# EAGLE design hw2 (EAGLE 7.5.0)
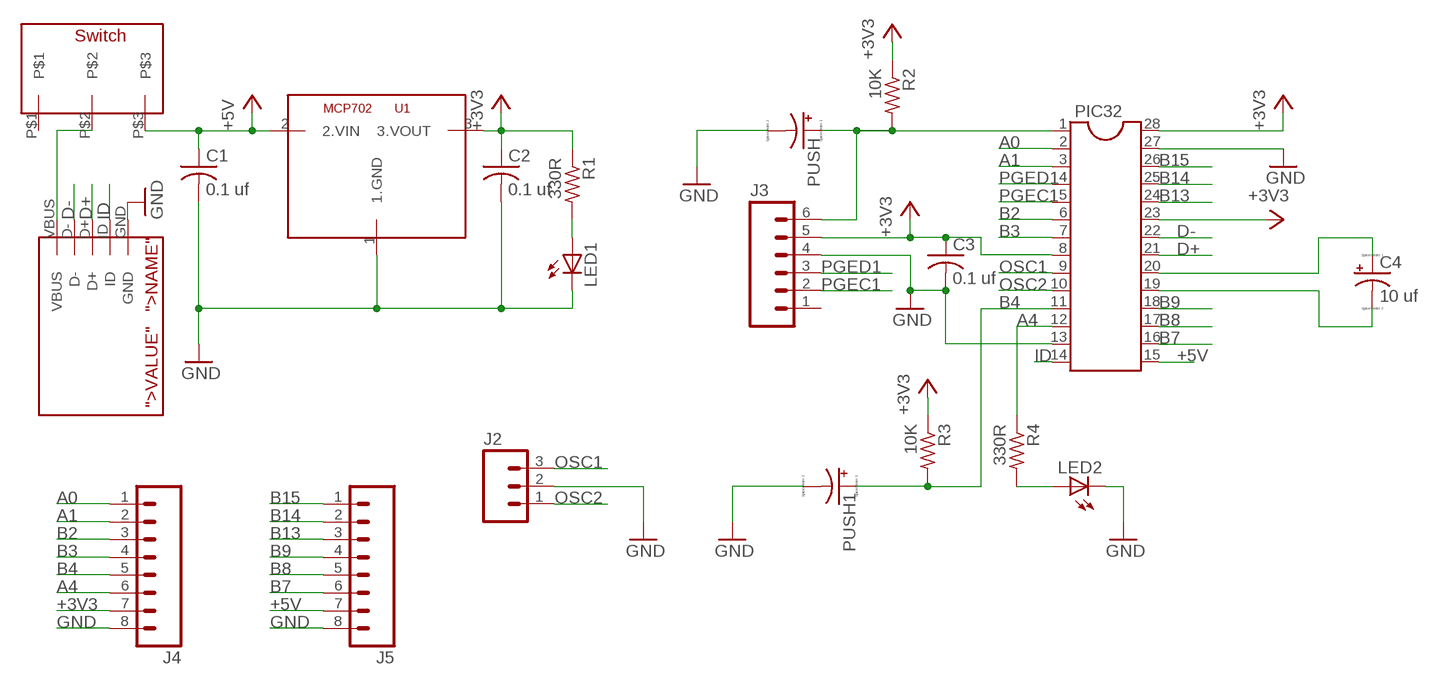
[diagram p0: schematic, sheet 1]

## Parts
C1  0.1 uf  C-US025-024X044  [C025-024X044]
C2  0.1 uf  C-US025-024X044  [C025-024X044]
C3  0.1 uf  C-US025-024X044  [C025-024X044]
C4  10 uf  CPOL-USTT2D4  [TT2D4]
J2  M03LOCK  [1X03_LOCK]
J3  M06NO_SILK_YES_STOP  [1X06_NO_SILK_YES_STOP]
J4  M08NO_SILK  [1X08_PIN1_NO_SILK]
J5  M08NO_SILK  [1X08_PIN1_NO_SILK]
LED1  LED3MM  [LED3MM]
LED2  LED3MM  [LED3MM]
PIC32  DIL28-3  [DIL28-3]
PUSH  CPOL-USTAP5-60  [TAP5-60]
PUSH1  CPOL-USTAP5-60  [TAP5-60]
R1  330R  R-US_0204/7  [0204/7]
R2  10K  R-US_0204/7  [0204/7]
R3  10K  R-US_0204/7  [0204/7]
R4  330R  R-US_0204/7  [0204/7]
U$1  SWITCH  [SWITCH]
U$2  MCP1702  [TO92]
U$3  USBNEW  [USB-MB-H]

## Nets
+3V3: C2.1 C3.1 J3.5(VDD) J4.7 PIC32.8 PIC32.23 PIC32.28 R1.1 R2.1 R3.1 U$2.3(3.VOUT)
+5V: C1.1 J5.7 PIC32.15 U$1.P$3 U$2.2(2.VIN)
A0: J4.1 PIC32.2
A1: J4.2 PIC32.3
A4: J4.6 PIC32.12 R4.1
B2: J4.3 PIC32.6
B3: J4.4 PIC32.7
B4: J4.5 PIC32.11 PUSH1.+ R3.2
B7: J5.6 PIC32.16
B8: J5.5 PIC32.17
B9: J5.4 PIC32.18
B13: J5.3 PIC32.24
B14: J5.2 PIC32.25
B15: J5.1 PIC32.26
D+: PIC32.21 U$3.D+
D-: PIC32.22 U$3.D-
GND: C1.2 C2.2 C3.2 J2.2 J3.4(VSS) J4.8 J5.8 LED1.K(C) LED2.K(C) PIC32.13 PIC32.27 PUSH1.- PUSH.- U$2.1(1.GND) U$3.GND
ID: PIC32.14 U$3.ID
N$1: U$1.P$2 U$3.VBUS
N$2: LED1.A R1.2
N$3: J3.6(MCLB) PIC32.1 PUSH.+ R2.2
N$6: LED2.A R4.2
N$7: C4.+ PIC32.20
N$8: C4.- PIC32.19
OSC1: J2.3 PIC32.9
OSC2: J2.1 PIC32.10
PGEC1: J3.2(PGC) PIC32.5
PGED1: J3.3(PGD) PIC32.4
Unconnected: J3.1(PGM) U$1.P$1

## Library data of the parts
C1-C3 = PIC32_Circuit:C-US: CAPACITOR, American symbol
C4 PUSH PUSH1 = PIC32_Circuit:CPOL-US: POLARIZED CAPACITOR, American symbol
J2 = PIC32_Circuit:M03: Header 3 Standard 3-pin 0.1" header. Use with straight break away headers (SKU : PRT-00116), right angle break away headers (PRT-00553), swiss pins (PRT-00743), machine pins (PRT-00117), and female headers (PRT-00115). Molex polarized connector foot print use with SKU : PRT-08232 with associated crimp pins and housings.
J3 = PIC32_Circuit:M06: Header 6 Standard 6-pin 0.1" header. Use with straight break away headers (SKU : PRT-00116), right angle break away headers (PRT-00553), swiss pins (PRT-00743), machine pins (PRT-00117), and female headers (PRT-00115). Molex polarized connector foot print use with SKU : PRT-08094 with associated crimp pins and housings. NOTES ON THE VARIANTS LOCK and LOCK_LONGPADS... This footprint was designed to help hold the alignment of a through-hole component (i.e. 6-pin header) while soldering it into place. You may notice that each hole has been shifted either up or down by 0.005 of an inch from it's more standard position (which is a perfectly straight line). This slight alteration caused the pins (the squares in the middle) to touch the edges of the holes. Because they are alternating, it causes a "brace" to hold the component in place. 0.005 has proven to be the perfect amount of "off-center" position when using our standard breakaway headers. Although looks a little odd when you look at the bare footprint, once you have a header in there, the alteration is very hard to notice. Also,if you push a header all the way into place, it is covered up entirely on the bottom side. This idea of altering the position of holes to aid alignment will be further integrated into the Sparkfun Library for other footprints. It can help hold any component with 3 or more connection pins.
J4 J5 = PIC32_Circuit:M08: Header 8 Standard 8-pin 0.1" header. Use with straight break away headers (SKU : PRT-00116), right angle break away headers (PRT-00553), swiss pins (PRT-00743), machine pins (PRT-00117), and female headers (PRT-00115).
LED1 LED2 = PIC32_Circuit:LED: LED OSRAM: - CHIPLED LG R971, LG N971, LY N971, LG Q971, LY Q971, LO R971, LY R971 LH N974, LH R974 LS Q976, LO Q976, LY Q976 LO Q996 - Hyper CHIPLED LW Q18S LB Q993, LB Q99A, LB R99A - SideLED LS A670, LO A670, LY A670, LG A670, LP A670 LB A673, LV A673, LT A673, LW A673 LH A674 LY A675 LS A676, LA A676, LO A676, LY A676, LW A676 LS A679, LY A679, LG A679 - Hyper Micro SIDELED® LS Y876, LA Y876, LO Y876, LY Y876 LT Y87S - SmartLED LW L88C, LW L88S LB L89C, LB L89S, LG L890 LS L89K, LO L89K, LY L89K LS L896, LA L896, LO L896, LY L896 - TOPLED LS T670, LO T670, LY T670, LG T670, LP T670 LSG T670, LSP T670, LSY T670, LOP T670, LYG T670 LG T671, LOG T671, LSG T671 LB T673, LV T673, LT T673, LW T673 LH T674 LS T676, LA T676, LO T676, LY T676, LB T676, LH T676, LSB T676, LW T676 LB T67C, LV T67C, LT T67C, LS T67K, LO T67K, LY T67K, LW E67C LS E67B, LA E67B, LO E67B, LY E67B, LB E67C, LV E67C, LT E67C LW T67C LS T679, LY T679, LG T679 LS T770, LO T770, LY T770, LG T770, LP T770 LB T773, LV T773, LT T773, LW T773 LH T774 LS E675, LA E675, LY E675, LS T675 LS T776, LA T776, LO T776, LY T776, LB T776 LHGB T686 LT T68C, LB T68C - Hyper Mini TOPLED® LB M676 - Mini TOPLED Santana® LG M470 LS M47K, LO M47K, LY M47K Source: http://www.osram.convergy.de LUXEON: - LUMILED® LXK2-PW12-R00, LXK2-PW12-S00, LXK2-PW14-U00, LXK2-PW14-V00 LXK2-PM12-R00, LXK2-PM12-S00, LXK2-PM14-U00 LXK2-PE12-Q00, LXK2-PE12-R00, LXK2-PE12-S00, LXK2-PE14-T00, LXK2-PE14-U00 LXK2-PB12-K00, LXK2-PB12-L00, LXK2-PB12-M00, LXK2-PB14-N00, LXK2-PB14-P00, LXK2-PB14-Q00 LXK2-PR12-L00, LXK2-PR12-M00, LXK2-PR14-Q00, LXK2-PR14-R00 LXK2-PD12-Q00, LXK2-PD12-R00, LXK2-PD12-S00 LXK2-PH12-R00, LXK2-PH12-S00 LXK2-PL12-P00, LXK2-PL12-Q00, LXK2-PL12-R00 Source: www.luxeon.com KINGBRIGHT: KA-3528ASYC Source: www.kingbright.com
PIC32 = PIC32_Circuit:DIL28: Dual In Line
R1-R4 = PIC32_Circuit:R-US_: RESISTOR, American symbol
U$1 = PIC32_Circuit:SWITCH
U$2 = PIC32_Circuit:MCP1702
U$3 = PIC32_Circuit:USBNEW

## Board
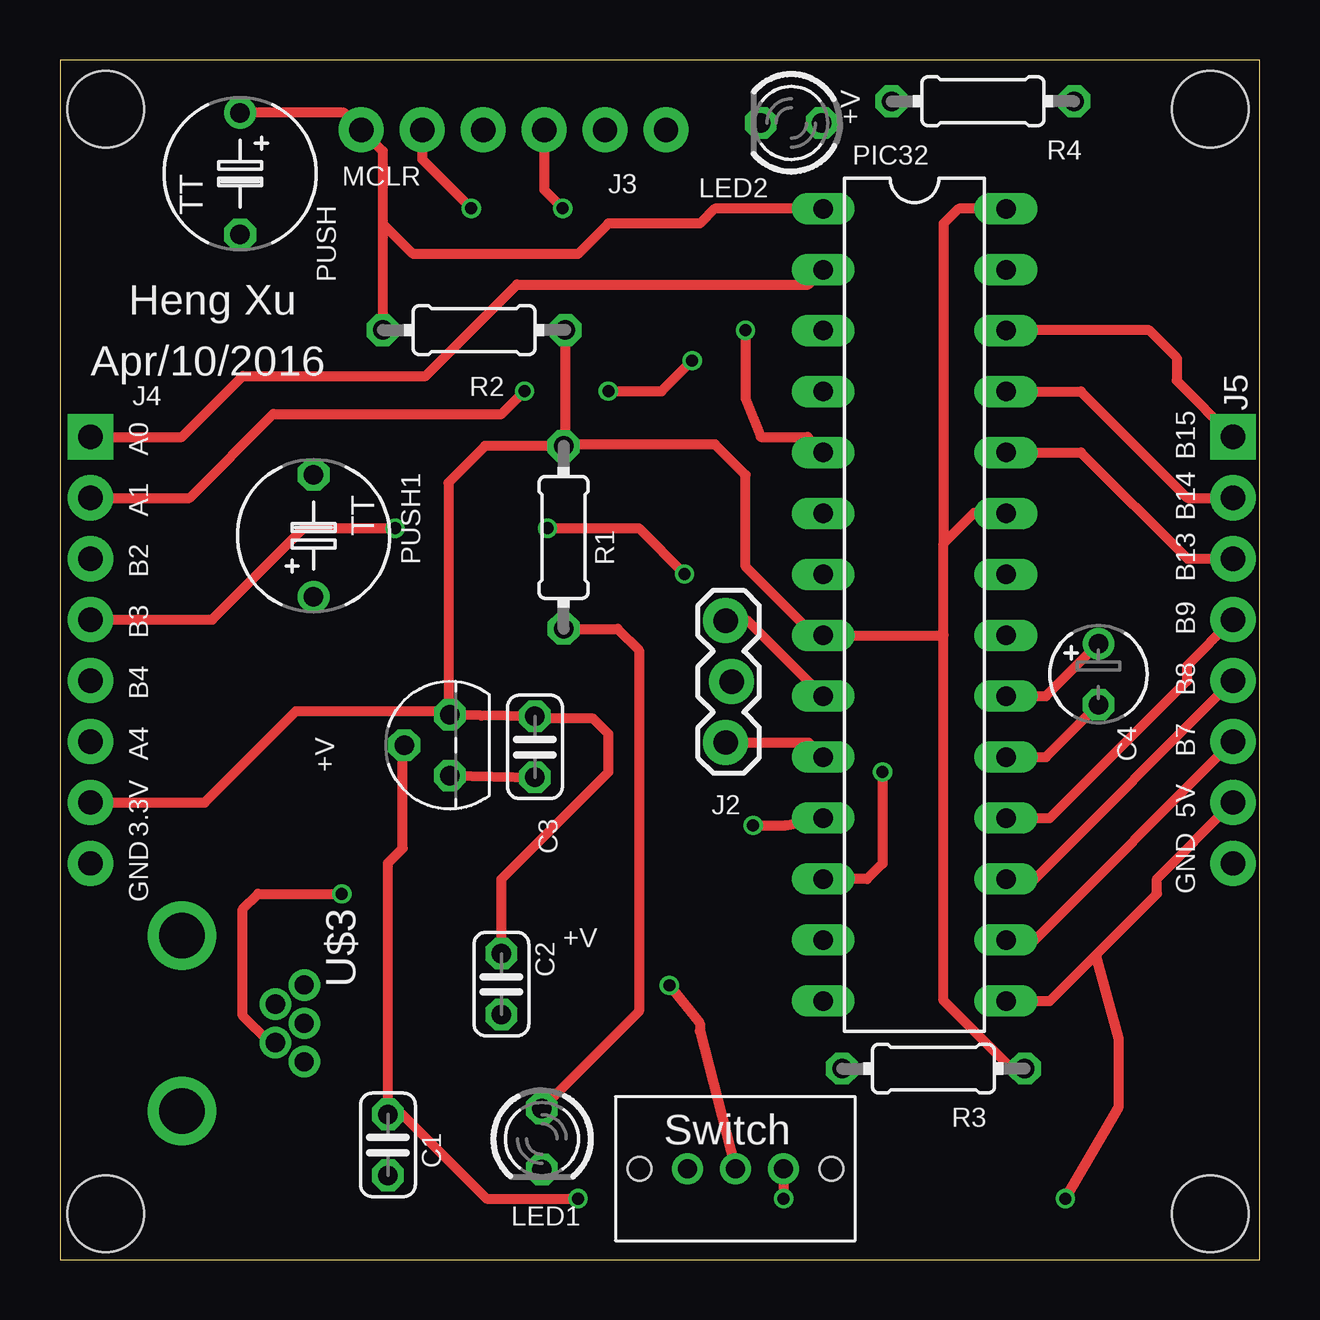
[diagram p1: board, top side]
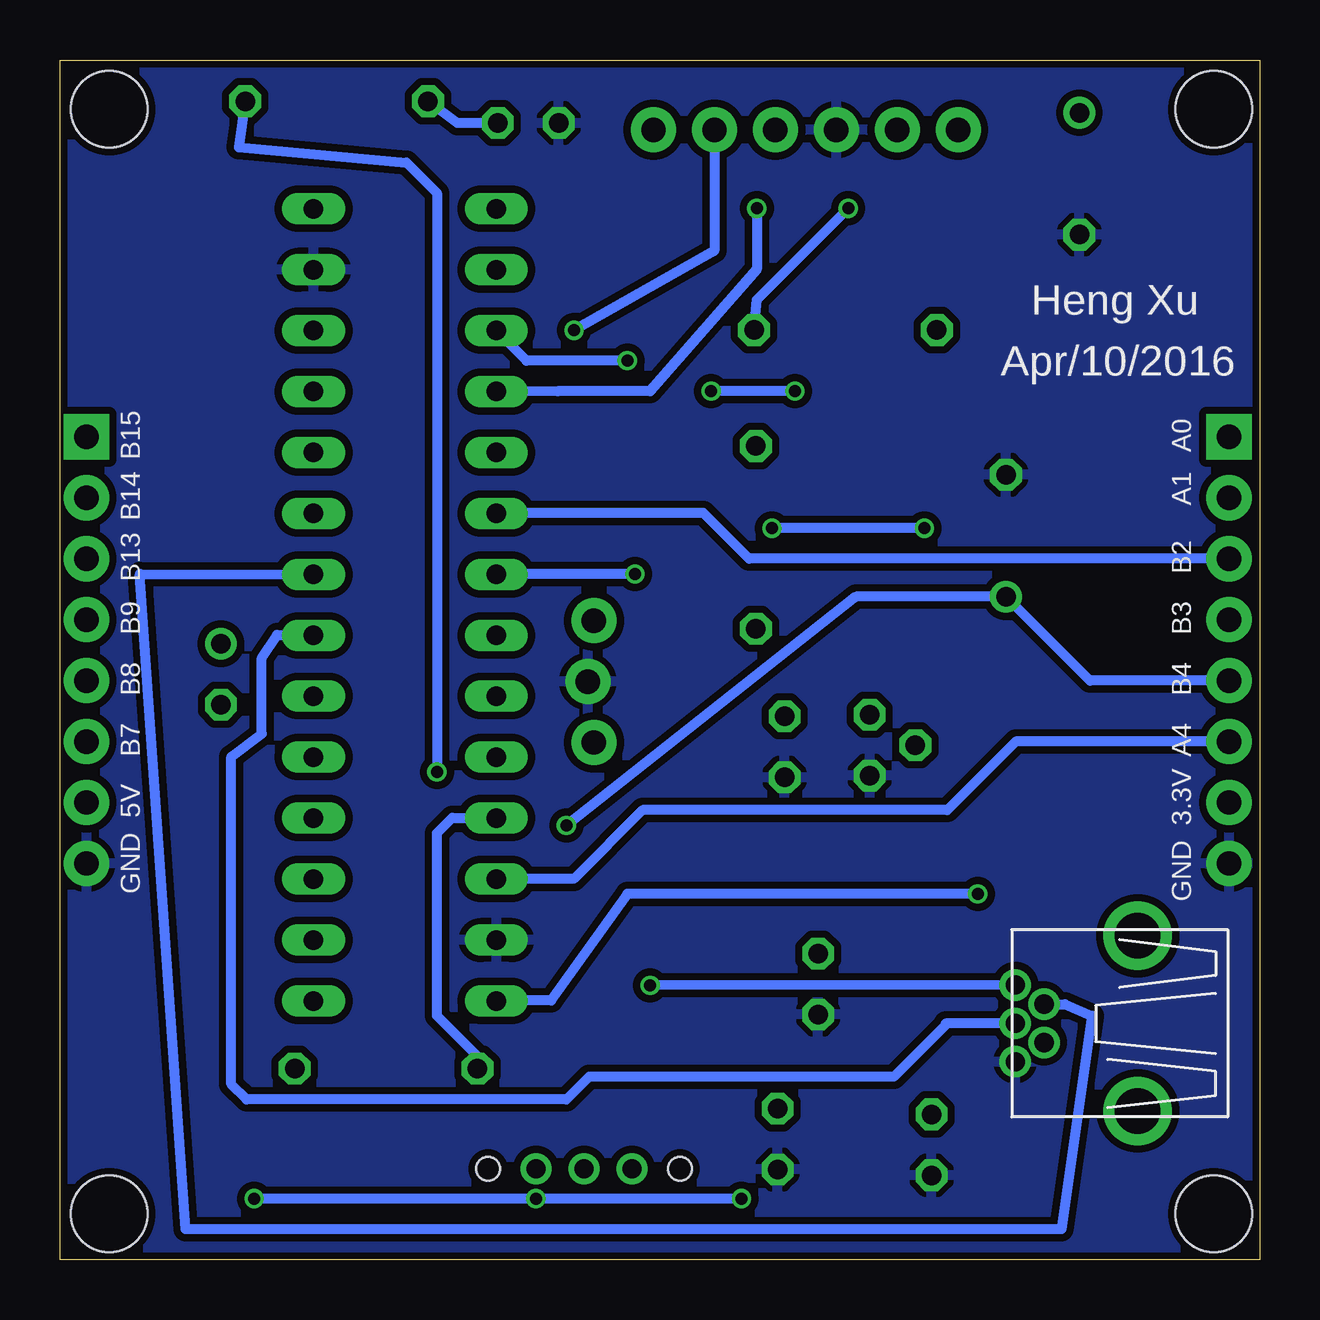
[diagram p2: board, bottom side, seen from below]

Size 50 x 50 mm. Coordinates in mm from the lower left corner, seen from the top.
Outline: 0,0 50,0 50,50 0,50 0,0
Copper layers (1*16): Top 0.035mm / dielectric 1.5mm / Bottom 0.035mm
Design rules "SeeedStudio_2layer_DRU_no_angle_20140221": minimum track width 6mil, minimum drill 12mil, track to track 6mil, track to pad 6mil, pad to pad 6mil, via to via 6mil, smd to smd 0mil, copper to edge 10mil, drill to drill 10mil, minimum pad ring 10mil, minimum via ring 6mil, stop-mask expansion 2mil, vias tented up to drill 100mil, thermal gap 10mil
Holes 3.2 mm at 1.91,47.94 1.91,1.91 47.94,47.94 47.94,1.91

### Footprints (pad centres in the part's own frame; a part is rotated, then mirrored left to right if it is on the bottom)
C025-024X044 = drill 0.813 octagon: 1 -1.27,0; 2 1.27,0
TT2D4 = drill 0.813: + -1.27,0 | drill 0.813 octagon: - 1.27,0
1X03_LOCK = drill 1.016 pad 1.88: 1 0,0.127; 2 2.54,-0.127; 3 5.08,0.127
1X06_NO_SILK_YES_STOP = drill 1.016 pad 1.88: 1 0,0; 2 2.54,0; 3 5.08,0; 4 7.62,0; 5 10.16,0; 6 12.7,0
1X08_PIN1_NO_SILK = drill 1.016 pad 1.88 square: 1 0,0 | drill 1.016 pad 1.88: 2 2.54,0; 3 5.08,0; 4 7.62,0; 5 10.16,0; 6 12.7,0; 7 15.24,0; 8 17.78,0
LED3MM = drill 0.813 octagon: A -1.27,0; K 1.27,0
DIL28-3 = drill 0.813 long: 1 -16.51,-3.81; 2 -13.97,-3.81; 3 -11.43,-3.81; 4 -8.89,-3.81; 5 -6.35,-3.81; 6 -3.81,-3.81; 7 -1.27,-3.81; 8 1.27,-3.81; 9 3.81,-3.81; 10 6.35,-3.81; 11 8.89,-3.81; 12 11.43,-3.81; 13 13.97,-3.81; 14 16.51,-3.81; 15 16.51,3.81; 16 13.97,3.81; 17 11.43,3.81; 18 8.89,3.81; 19 6.35,3.81; 20 3.81,3.81; 21 1.27,3.81; 22 -1.27,3.81; 23 -3.81,3.81; 24 -6.35,3.81; 25 -8.89,3.81; 26 -11.43,3.81; 27 -13.97,3.81; 28 -16.51,3.81
TAP5-60 = drill 0.813: + -2.54,0 | drill 0.813 octagon: - 2.54,0
0204/7 = drill 0.813 octagon: 1 -3.81,0; 2 3.81,0
SWITCH = drill 0.8: P$1 -2,0; P$2 0,0; P$3 2,0 | hole 1: -4,0; 4,0
TO92 = drill 0.813 octagon: 1 -1.27,0; 2 0,1.905; 3 1.27,0
USB-MB-H = drill 0.8 pad 1.219: D+ 5.1,0; D- 3.9,0.8; GND 5.1,-1.6; ID 3.9,-0.8; VBUS 5.1,1.6 | drill 1.9: P$6 0,-3.65; P$7 0,3.65

### Placement (x,y rotation side)
C1  13.67,4.78 270 top
C2  18.4,11.48 270 top
C3  19.8,21.37 270 top
C4  43.29,24.4 270 top
J2  27.87,21.55 90 top
J3  25.26,47.09 180 top
J4  1.27,34.29 270 top
J5  48.9,34.29 270 top
LED1  20.09,5.02 270 top
LED2  30.48,47.38 180 top
PIC32  35.62,27.29 270 top
PUSH  7.51,45.26 270 top
PUSH1  10.57,30.17 90 top
R1  20.99,30.1 270 top
R2  17.26,38.74 180 top
R3  36.41,7.96 180 top
R4  38.47,48.28 180 top
U$1  28.16,3.78 0 top
U$2  16.25,21.44 90 top
U$3  5.08,9.84 0 top

### Tracks (layer width: path | path; a pad name or v marks a point on that pad's centre or on a via)
+3V3  (via drill 0.5)
  Top 0.406: R1.1 21.07,33.99 R2.1 | J3.5 15.1,45.86 v17.14,43.81 | U$2.3 17.56,22.67 C3.1 19.89,22.54 22.23,22.54 22.86,21.91 22.86,20.32 18.4,15.86 C2.1 | R1.1 21.05,33.97 27.3,33.97 28.57,32.7 28.57,28.89 31.45,26.02 PIC32.8 36.81,26.02 36.83,26.04 | R1.1 17.72,33.91 16.19,32.38 16.19,22.77 U$2.3 | R3.1 39.67,7.96 36.83,10.79 36.83,26.04 | 36.83,26.04 36.83,29.84 | 36.83,29.84 38.1,31.11 39.41,31.11 PIC32.23 | PIC32.28 37.45,43.8 36.83,43.18 36.83,29.84 | J4.7 6.03,19.05 9.84,22.86 16.1,22.86 U$2.3
  Bottom 0.406: R2.1 20.95,40.01 v17.14,43.81
+5V  (via drill 0.5)
  Top 0.406: PIC32.15 41.26,10.78 43.18,12.7 | 43.18,12.7 45.72,15.24 45.72,15.88 J5.7 | v21.59,2.54 17.78,2.54 14.27,6.05 C1.1 13.67,16.53 14.29,17.14 14.29,21.38 U$2.2 | v41.91,2.54 44.13,6.35 44.13,9.21 43.18,12.7 | U$1.P$3 v30.16,2.54
  Bottom 0.406: v21.59,2.54 v30.16,2.54 v41.91,2.54
A0
  Top 0.406: J4.1 5.08,34.29 7.62,36.83 15.24,36.83 19.05,40.64 31.19,40.64 PIC32.2
A1  (via drill 0.5)
  Top 0.406: J4.2 5.4,31.75 8.89,35.24 18.41,35.24 v19.37,36.2 | v22.86,36.2 25.08,36.2 v26.35,37.47
  Bottom 0.406: v19.37,36.2 v22.86,36.2 | v26.35,37.47 30.55,37.47 PIC32.3
A4  (via drill 0.5)
  Top 0.406: v34.29,20.32 34.29,16.51 33.64,15.86 PIC32.12
  Bottom 0.406: J4.6 10.16,21.59 13.02,18.73 25.72,18.73 28.57,15.88 31.8,15.88 PIC32.12 | R4.1 42.55,46.35 35.56,45.72 34.29,44.45 v34.29,20.32
B2
  Bottom 0.406: J4.3 21.27,29.21 23.18,31.11 31.8,31.11 PIC32.6
B3  (via drill 0.5)
  Top 0.406: J4.4 6.35,26.67 10.16,30.48 v13.97,30.48 | v20.32,30.48 24.13,30.48 v26.04,28.57
  Bottom 0.406: v13.97,30.48 v20.32,30.48 | v26.04,28.57 31.8,28.57 PIC32.7
B4  (via drill 0.5)
  Top 0.406: v28.89,18.1 30.24,18.1 PIC32.11
  Bottom 0.406: PIC32.11 31.82,18.41 33.66,18.41 34.29,17.78 34.29,10.16 32.6,8.47 R3.2 32.58,7.94 | v28.89,18.1 16.82,27.63 PUSH1.+ 7.07,24.13 J4.5
B7
  Top 0.406: PIC32.16 40.62,13.32 J5.6
B8
  Top 0.406: PIC32.17 40.62,15.86 J5.5
B9
  Top 0.406: PIC32.18 41.26,18.4 46.99,24.13 46.99,24.77 J5.4
B13
  Top 0.406: PIC32.24 42.56,33.64 46.99,29.21 J5.3
B14
  Top 0.406: PIC32.25 42.56,36.18 46.99,31.75 J5.2
B15
  Top 0.406: PIC32.26 39.45,38.73 45.4,38.73 46.55,37.59 46.55,36.64 J5.1
D+
  Bottom 0.406: PIC32.21 39.45,26.04 40.96,26.04 41.59,25.08 41.59,21.91 42.86,20.95 42.86,7.3 42.23,6.67 28.89,6.67 27.94,7.62 15.24,7.62 13.08,9.78 13.08,9.84 U$3.D+
D-
  Bottom 0.406: U$3.D- 8.1,10.64 6.99,10.16 8.26,1.27 44.77,1.27 46.67,28.57 PIC32.22
GND
  Top 0.406: U$2.1 16.29,20.17 C3.2
  pour Bottom (isolate 0.305): 0,0 0,49.53 49.85,49.53 49.85,0
ID  (via drill 0.5)
  Top 0.406: U$3.ID 8.74,9.04 7.62,10.16 7.62,14.61 8.26,15.24 v11.75,15.24
  Bottom 0.406: v11.75,15.24 26.35,15.24 29.53,10.79 31.8,10.79 PIC32.14
N$1  (via drill 0.5)
  Top 0.406: v25.4,11.43 26.67,9.84 26.67,9.53 U$1.P$2
  Bottom 0.406: U$3.VBUS v25.4,11.43
N$2
  Top 0.406: R1.2 23.24,26.29 24.13,25.4 24.13,10.34 LED1.A
N$3
  Top 0.406: PUSH.+ 11.85,47.8 J3.6 13.45,46.2 13.45,43.18 | 13.45,43.18 R2.2 | PIC32.1 27.29,43.8 26.67,43.18 22.86,43.18 21.59,41.91 14.72,41.91 13.45,43.18
N$6
  Bottom 0.406: LED2.A 33.44,47.38 R4.2
N$7
  Top 0.406: PIC32.20 41.1,23.48 C4.+
N$8
  Top 0.406: PIC32.19 41.1,20.94 C4.-
OSC1
  Top 0.406: J2.3 28.66,26.63 PIC32.9
OSC2
  Top 0.406: J2.1 31.2,21.55 PIC32.10
PGEC1  (via drill 0.5)
  Top 0.406: v28.57,38.73 28.57,35.88 29.21,34.29 31.16,34.29 PIC32.5
  Bottom 0.406: J3.2 22.72,42.05 v28.57,38.73
PGED1  (via drill 0.5)
  Top 0.406: J3.3 20.18,44.59 v20.95,43.81
  Bottom 0.406: v20.95,43.81 20.95,41.27 25.4,36.2 29.25,36.2 PIC32.4

### Text on the board
tPlace: +V | MCLR | Heng Xu | Apr/10/2016 | A0 | B15 | A1 | B14 | B2 | B13 | B3 | B9 | B4 | B8 | A4 | B7 | 3.3V | +V | 5V | GND | GND | +V
bPlace: Heng Xu | Apr/10/2016 | A0 | B15 | A1 | B14 | B2 | B13 | B3 | B9 | B4 | B8 | A4 | B7 | 3.3V | 5V | GND | GND